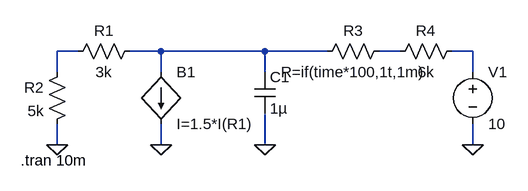
[diagram p0: schematic 8-38.asc]
8-38.asc, the LTspice schematic file:
Version 4
SHEET 1 880 680
WIRE 48 96 16 96
WIRE 176 96 128 96
WIRE 336 96 176 96
WIRE 432 96 336 96
WIRE 544 96 512 96
WIRE 656 96 624 96
WIRE 16 128 16 96
WIRE 176 128 176 96
WIRE 336 128 336 96
WIRE 656 128 656 96
WIRE 16 240 16 208
WIRE 176 240 176 208
WIRE 336 240 336 192
WIRE 656 240 656 208
FLAG 16 240 0
FLAG 336 240 0
FLAG 656 240 0
FLAG 176 240 0
SYMBOL res 144 80 R90
WINDOW 0 0 56 VBottom 2
WINDOW 3 32 56 VTop 2
SYMATTR InstName R1
SYMATTR Value 3k
SYMBOL res 32 112 M0
SYMATTR InstName R2
SYMATTR Value 5k
SYMBOL cap 320 128 R0
SYMATTR InstName C1
SYMATTR Value 1µ
SYMBOL res 528 80 R90
WINDOW 0 0 56 VBottom 2
WINDOW 3 32 56 VTop 2
SYMATTR InstName R3
SYMATTR Value R=if(time*100,1t,1m)
SYMBOL res 640 80 R90
WINDOW 0 0 56 VBottom 2
WINDOW 3 32 56 VTop 2
SYMATTR InstName R4
SYMATTR Value 6k
SYMBOL voltage 656 112 R0
WINDOW 123 0 0 Left 2
WINDOW 39 0 0 Left 2
SYMATTR InstName V1
SYMATTR Value 10
SYMBOL bi 176 128 R0
SYMATTR InstName B1
SYMATTR Value I=1.5*I(R1)
TEXT -40 264 Left 2 !.tran 10m

The netlist it stands for:
* 8-38.asc
R1 N002 N001 3k
R2 N001 0 5k
C1 N002 0 1µ
R3 N003 N002 R=if(time*100,1t,1m)
R4 N004 N003 6k
V1 N004 0 10
B1 N002 0 I=1.5*I(R1)
.tran 10m
.backanno
.end